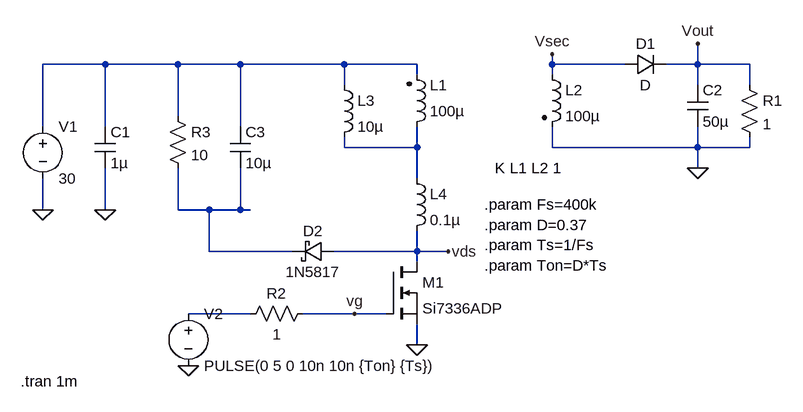
[diagram p0: schematic RDCFlyback.asc]
RDCFlyback.asc, the LTspice schematic file:
Version 4
SHEET 1 968 680
WIRE -80 48 -176 48
WIRE 32 48 -80 48
WIRE 128 48 32 48
WIRE 288 48 128 48
WIRE 400 48 288 48
WIRE 608 48 608 32
WIRE 720 48 608 48
WIRE 832 48 832 16
WIRE 832 48 784 48
WIRE 912 48 832 48
WIRE 400 64 400 48
WIRE 608 64 608 48
WIRE 288 80 288 48
WIRE 832 80 832 48
WIRE 912 80 912 48
WIRE 32 128 32 48
WIRE -176 144 -176 48
WIRE -80 144 -80 48
WIRE 128 144 128 48
WIRE 288 176 288 160
WIRE 400 176 400 144
WIRE 400 176 288 176
WIRE 608 176 608 144
WIRE 832 176 832 144
WIRE 832 176 608 176
WIRE 912 176 912 160
WIRE 912 176 832 176
WIRE 832 208 832 176
WIRE 400 224 400 176
WIRE -176 272 -176 224
WIRE -80 272 -80 208
WIRE 32 272 32 208
WIRE 80 272 32 272
WIRE 128 272 128 208
WIRE 128 272 80 272
WIRE 144 272 128 272
WIRE 80 336 80 272
WIRE 208 336 80 336
WIRE 400 336 400 304
WIRE 400 336 272 336
WIRE 448 336 400 336
WIRE 400 352 400 336
WIRE 144 432 48 432
WIRE 304 432 224 432
WIRE 352 432 304 432
WIRE 400 480 400 448
FLAG -176 272 0
FLAG -80 272 0
FLAG 400 480 0
FLAG 832 208 0
FLAG 832 16 Vout
FLAG 608 32 Vsec
FLAG 448 336 vds
FLAG 304 432 vg
FLAG 48 512 0
SYMBOL voltage -176 128 R0
SYMATTR InstName V1
SYMATTR Value 30
SYMBOL cap -96 144 R0
SYMATTR InstName C1
SYMATTR Value 1µ
SYMBOL ind2 384 160 M180
WINDOW 0 36 80 Left 2
WINDOW 3 36 40 Left 2
SYMATTR InstName L1
SYMATTR Value 100µ
SYMATTR Type ind
SYMBOL nmos 352 352 R0
SYMATTR InstName M1
SYMATTR Value Si7336ADP
SYMBOL ind2 592 48 R0
SYMATTR InstName L2
SYMATTR Value 100µ
SYMATTR Type ind
SYMBOL ind 272 64 R0
SYMATTR InstName L3
SYMATTR Value 10µ
SYMBOL ind 384 208 R0
SYMATTR InstName L4
SYMATTR Value 0.1µ
SYMBOL diode 720 64 R270
WINDOW 0 32 32 VTop 2
WINDOW 3 0 32 VBottom 2
SYMATTR InstName D1
SYMBOL cap 816 80 R0
SYMATTR InstName C2
SYMATTR Value 50µ
SYMBOL res 896 64 R0
SYMATTR InstName R1
SYMATTR Value 1
SYMBOL voltage 48 416 R0
WINDOW 123 0 0 Left 0
WINDOW 39 0 0 Left 0
SYMATTR InstName V2
SYMATTR Value PULSE(0 5 0 10n 10n {Ton} {Ts})
SYMBOL res 240 416 R90
WINDOW 0 0 56 VBottom 2
WINDOW 3 32 56 VTop 2
SYMATTR InstName R2
SYMATTR Value 1
SYMBOL schottky 272 320 R90
WINDOW 0 0 32 VBottom 2
WINDOW 3 32 32 VTop 2
SYMATTR InstName D2
SYMATTR Value 1N5817
SYMATTR Description Diode
SYMATTR Type diode
SYMBOL res 16 112 R0
SYMATTR InstName R3
SYMATTR Value 10
SYMBOL cap 112 144 R0
SYMATTR InstName C3
SYMATTR Value 10µ
TEXT 504 264 Left 2 !.param Fs=400k\n.param D=0.37\n.param Ts=1/Fs\n.param Ton=D*Ts
TEXT -210 536 Left 2 !.tran 1m
TEXT 520 208 Left 2 !K L1 L2 1

The netlist it stands for:
* RDCFlyback.asc
V1 N001 0 30
C1 N001 0 1µ
L1 N002 N001 100µ
M1 vds vg 0 0 Si7336ADP
L2 Vsec 0 100µ
L3 N001 N002 10µ
L4 N002 vds 0.1µ
D1 Vsec Vout D
C2 Vout 0 50µ
R1 Vout 0 1
V2 N004 0 PULSE(0 5 0 10n 10n {Ton} {Ts})
R2 vg N004 1
D2 vds N003 1N5817
R3 N001 N003 10
C3 N001 N003 10µ
.model D D
.lib standard.dio
.model NMOS NMOS
.model PMOS PMOS
.lib standard.mos
.param Fs=400k
.param D=0.37
.param Ts=1/Fs
.param Ton=D*Ts
.tran 1m
K L1 L2 1
.backanno
.end